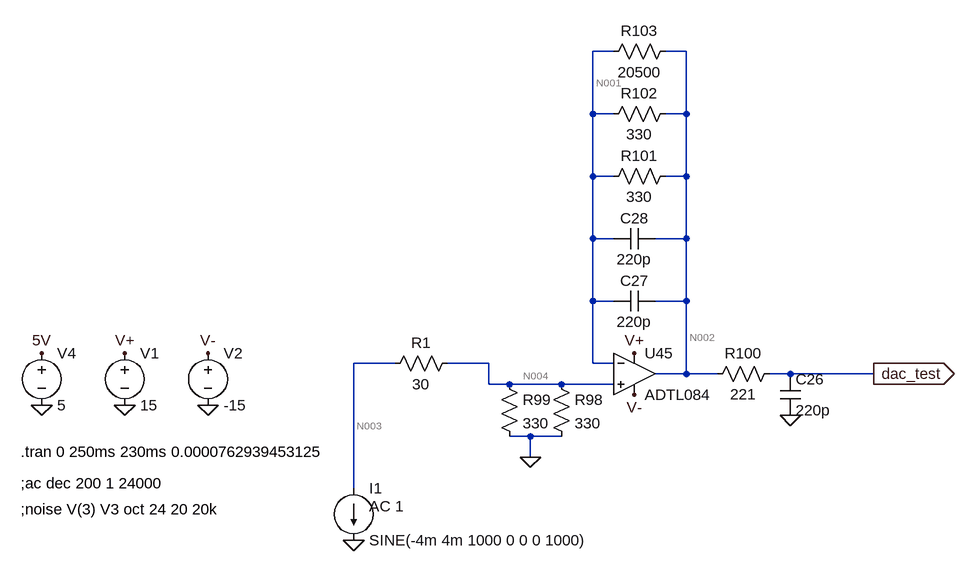
[diagram p0: schematic stargate_323_ltspice_dacTest.asc]
stargate_323_ltspice_dacTest.asc, the LTspice schematic file:
Version 4
SHEET 1 3908 3476
WIRE -3536 -768 -3568 -768
WIRE -3424 -768 -3456 -768
WIRE -3568 -672 -3568 -768
WIRE -3536 -672 -3568 -672
WIRE -3424 -672 -3424 -768
WIRE -3424 -672 -3456 -672
WIRE -3568 -576 -3568 -672
WIRE -3536 -576 -3568 -576
WIRE -3424 -576 -3424 -672
WIRE -3424 -576 -3456 -576
WIRE -3568 -480 -3568 -576
WIRE -3536 -480 -3568 -480
WIRE -3424 -480 -3424 -576
WIRE -3424 -480 -3472 -480
WIRE -3568 -384 -3568 -480
WIRE -3536 -384 -3568 -384
WIRE -3424 -384 -3424 -480
WIRE -3424 -384 -3472 -384
WIRE -3872 -288 -3936 -288
WIRE -3728 -288 -3792 -288
WIRE -3568 -288 -3568 -384
WIRE -3536 -288 -3568 -288
WIRE -3424 -272 -3424 -384
WIRE -3424 -272 -3472 -272
WIRE -3376 -272 -3424 -272
WIRE -3264 -272 -3296 -272
WIRE -3136 -272 -3264 -272
WIRE -3728 -256 -3728 -288
WIRE -3696 -256 -3728 -256
WIRE -3616 -256 -3696 -256
WIRE -3536 -256 -3616 -256
WIRE -3664 -176 -3696 -176
WIRE -3616 -176 -3664 -176
WIRE -3664 -144 -3664 -176
WIRE -3936 -96 -3936 -288
FLAG -4288 -224 0
FLAG -4288 -304 V+
FLAG -4160 -224 0
FLAG -4160 -304 V-
FLAG -4416 -224 0
FLAG -4416 -304 5V
FLAG -3504 -304 V+
FLAG -3504 -240 V-
FLAG -3936 -16 0
FLAG -3664 -144 0
FLAG -3264 -208 0
FLAG -3136 -272 dac_test
IOPIN -3136 -272 Out
SYMBOL voltage -4288 -320 R0
WINDOW 123 0 0 Left 0
WINDOW 39 0 0 Left 0
SYMATTR InstName V1
SYMATTR Value 15
SYMBOL voltage -4160 -320 R0
WINDOW 123 0 0 Left 0
WINDOW 39 0 0 Left 0
SYMATTR InstName V2
SYMATTR Value -15
SYMBOL voltage -4416 -320 R0
WINDOW 123 0 0 Left 0
WINDOW 39 0 0 Left 0
SYMATTR InstName V4
SYMATTR Value 5
SYMBOL OpAmps\\ADTL084 -3504 -336 R0
SYMATTR InstName U45
SYMBOL current -3936 -96 R0
WINDOW 123 24 28 Left 2
WINDOW 39 0 0 Left 0
SYMATTR InstName I1
SYMATTR Value SINE(-4m 4m 1000 0 0 0 1000)
SYMATTR Value2 AC 1
SYMBOL res -3632 -272 R0
SYMATTR InstName R98
SYMATTR Value 330
SYMBOL res -3712 -272 R0
SYMATTR InstName R99
SYMATTR Value 330
SYMBOL res -3280 -288 R90
WINDOW 0 0 56 VBottom 2
WINDOW 3 32 56 VTop 2
SYMATTR InstName R100
SYMATTR Value 221
SYMBOL cap -3280 -272 R0
SYMATTR InstName C26
SYMATTR Value 220p
SYMBOL cap -3472 -400 R90
WINDOW 0 0 32 VBottom 2
WINDOW 3 32 32 VTop 2
SYMATTR InstName C27
SYMATTR Value 220p
SYMBOL cap -3472 -496 R90
WINDOW 0 0 32 VBottom 2
WINDOW 3 32 32 VTop 2
SYMATTR InstName C28
SYMATTR Value 220p
SYMBOL res -3440 -592 R90
WINDOW 0 0 56 VBottom 2
WINDOW 3 32 56 VTop 2
SYMATTR InstName R101
SYMATTR Value 330
SYMBOL res -3440 -688 R90
WINDOW 0 0 56 VBottom 2
WINDOW 3 32 56 VTop 2
SYMATTR InstName R102
SYMATTR Value 330
SYMBOL res -3440 -784 R90
WINDOW 0 0 56 VBottom 2
WINDOW 3 32 56 VTop 2
SYMATTR InstName R103
SYMATTR Value 20500
SYMBOL res -3776 -304 R90
WINDOW 0 0 56 VBottom 2
WINDOW 3 32 56 VTop 2
SYMATTR InstName R1
SYMATTR Value 30
TEXT -4448 -104 Left 2 !;ac dec 200 1 24000
TEXT -4448 -152 Left 2 !.tran 0 250ms 230ms 0.0000762939453125
TEXT -4448 -64 Left 2 !;noise V(3) V3 oct 24 20 20k

The netlist it stands for:
* stargate_323_ltspice_dacTest.asc
V1 V+ 0 15
V2 V- 0 -15
V4 5V 0 5
XU45 N004 N001 V+ V- N002 ADTL084  ; pins In+ In- V+ V- OUT
I1 N003 0 SINE(-4m 4m 1000 0 0 0 1000) AC 1
R98 N004 0 330
R99 N004 0 330
R100 dac_test N002 221
C26 dac_test 0 220p
C27 N002 N001 220p
C28 N002 N001 220p
R101 N002 N001 330
R102 N002 N001 330
R103 N002 N001 20500
R1 N004 N003 30
;ac dec 200 1 24000
.tran 0 250ms 230ms 0.0000762939453125
;noise V(3) V3 oct 24 20 20k
.lib ADTL084.lib
.backanno
.end

* Results of the author's LTspice run, read from the files saved beside the schematic
* Operating Point, zero values left out:
*   V(v+) = 15 V
*   V(v-) = -15 V
*   V(5v) = 5 V
*   V(n001) = 660 mV
*   V(n004) = 660 mV
*   V(n002) = 660 mV
*   V(n003) = 780 mV
*   V(dac_test) = 660 mV
*   I(I1) = -4 mA
*   I(R1) = -4 mA
*   I(R102) = 3.611 pA
*   I(R101) = 3.611 pA
*   I(R99) = 2 mA
*   I(R98) = 2 mA
*   I(V2) = 5.124 mA
*   I(V1) = -5.124 mA
*   Ix(u45:1) = 7.28 pA
*   Ix(u45:2) = 7.28 pA
*   Ix(u45:3) = 5.124 mA
*   Ix(u45:4) = -5.124 mA
*   Ix(u45:5) = -8.6 pA
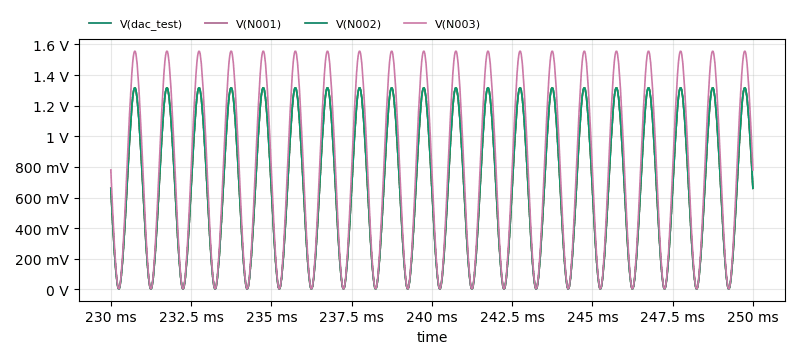
[diagram p1: Transient Analysis of stargate_323_ltspice_dacTest.asc, plotted from the saved traces]
* Transient Analysis, 1 run:
*   V(dac_test): min 3.447 mV, max 1.316 V, average 658.7 mV, rms 804.8 mV, last 660.3 mV
*   V(N001): min 3.435 mV, max 1.316 V, average 658.7 mV, rms 804.8 mV, last 660.1 mV
*   V(N002): min 3.435 mV, max 1.316 V, average 658.7 mV, rms 804.8 mV, last 660.1 mV
*   V(N003): min 4.053 mV, max 1.555 V, average 778.4 mV, rms 951.1 mV, last 780 mV